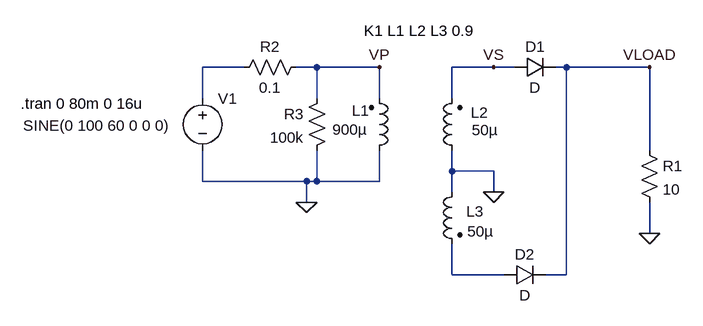
[diagram p0: schematic tranformer.asc]
tranformer.asc, the LTspice schematic file:
Version 4.1
SHEET 1 888 680
WIRE 208 64 144 64
WIRE 320 64 288 64
WIRE 416 64 320 64
WIRE 592 64 528 64
WIRE 624 64 592 64
WIRE 704 64 688 64
WIRE 832 64 704 64
WIRE 144 112 144 64
WIRE 320 112 320 64
WIRE 416 112 416 64
WIRE 528 112 528 64
WIRE 832 192 832 64
WIRE 528 224 528 192
WIRE 592 224 528 224
WIRE 144 240 144 192
WIRE 304 240 144 240
WIRE 320 240 320 192
WIRE 320 240 304 240
WIRE 416 240 416 192
WIRE 416 240 320 240
WIRE 528 256 528 224
WIRE 592 256 592 224
WIRE 304 272 304 240
WIRE 832 320 832 272
WIRE 528 384 528 336
WIRE 608 384 528 384
WIRE 704 384 704 64
WIRE 704 384 672 384
FLAG 304 272 0
FLAG 416 64 VP
FLAG 592 64 VS
FLAG 592 256 0
FLAG 832 320 0
FLAG 832 64 VLOAD
SYMBOL ind2 400 208 M180
WINDOW 0 -26 77 Left 2
WINDOW 3 -56 48 Left 2
SYMATTR InstName L1
SYMATTR Value 900µ
SYMATTR SpiceLine Rser=1m
SYMBOL ind2 544 208 R180
WINDOW 0 -40 74 Left 2
WINDOW 3 -55 47 Left 2
SYMATTR InstName L2
SYMATTR Value 50µ
SYMATTR SpiceLine Rser=1m
SYMBOL voltage 144 96 R0
WINDOW 3 -276 58 Left 2
WINDOW 123 0 0 Left 0
WINDOW 39 -277 81 Left 2
SYMATTR InstName V1
SYMATTR Value SINE(0 100 60 0 0 0)
SYMBOL res 816 176 R0
SYMATTR InstName R1
SYMATTR Value 10
SYMBOL diode 624 80 R270
WINDOW 0 32 32 VTop 2
WINDOW 3 0 32 VBottom 2
SYMATTR InstName D1
SYMBOL ind2 544 240 M0
WINDOW 0 -33 46 Left 2
WINDOW 3 -48 77 Left 2
SYMATTR InstName L3
SYMATTR Value 50µ
SYMATTR SpiceLine Rser=1m
SYMBOL diode 608 400 R270
WINDOW 0 32 32 VTop 2
WINDOW 3 0 32 VBottom 2
SYMATTR InstName D2
SYMBOL res 304 48 R90
WINDOW 0 0 56 VBottom 2
WINDOW 3 32 56 VTop 2
SYMATTR InstName R2
SYMATTR Value 0.1
SYMBOL res 336 96 M0
SYMATTR InstName R3
SYMATTR Value 100k
TEXT 392 8 Left 2 !K1 L1 L2 L3 0.9
TEXT -136 120 Left 2 !.tran 0 80m 0 16u

The netlist it stands for:
* tranformer.asc
L1 0 VP 900µ Rser=1m
L2 0 VS 50µ Rser=1m
V1 N001 0 SINE(0 100 60 0 0 0)
R1 VLOAD 0 10
D1 VS VLOAD D
L3 0 N002 50µ Rser=1m
D2 N002 VLOAD D
R2 VP N001 0.1
R3 VP 0 100k
.model D D
.lib standard.dio
K1 L1 L2 L3 0.9
.tran 0 80m 0 16u
.backanno
.end